# EAGLE design ButterflyFC (EAGLE 9.6.2)
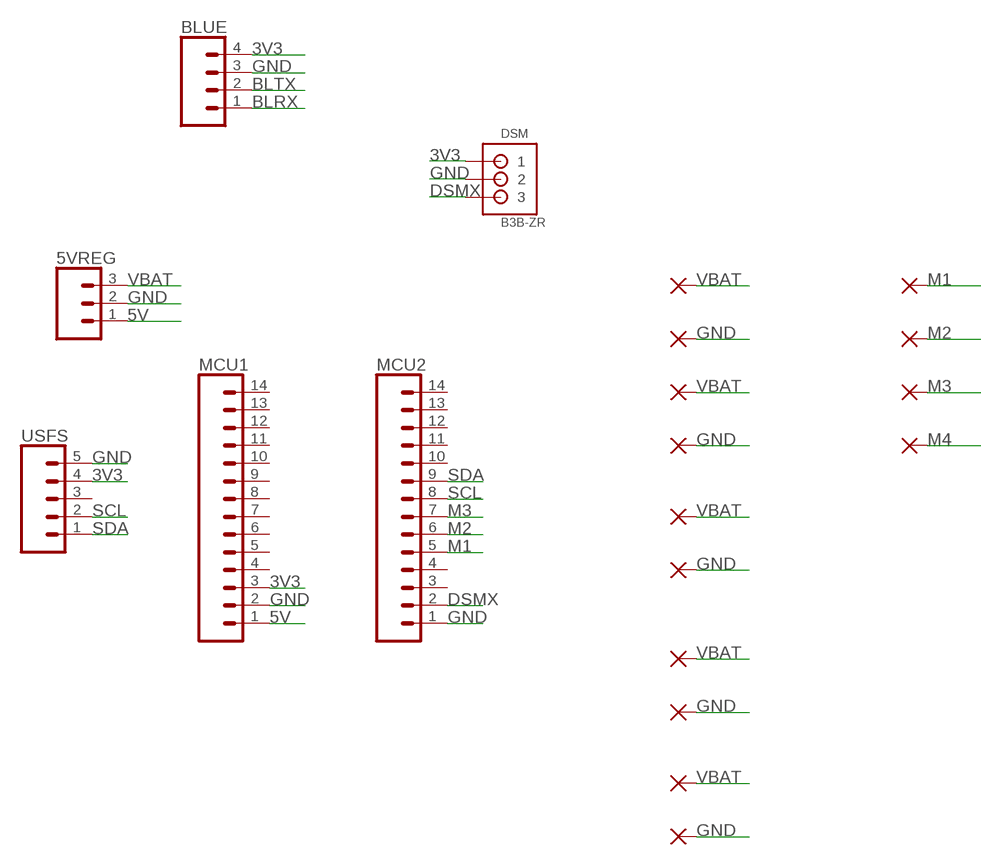
[diagram p0: schematic, sheet 1]

## Parts
5VREG  CONN_031X03_NO_SILK  [1X03_NO_SILK]
BLUE  CONN_041X04_NO_SILK  [1X04_NO_SILK]
DSM  B3B-ZR  [B3B-ZR]
MCU1  CONN_14NO_SILK  [1X14_NO_SILK]
MCU2  CONN_14NO_SILK  [1X14_NO_SILK]
PAD1  WIREPADSMD5-2,5  [5-2,5]
PAD2  WIREPADSMD5-2,5  [5-2,5]
PAD3  WIREPADSMD5-2,5  [5-2,5]
PAD4  WIREPADSMD5-2,5  [5-2,5]
PAD5  WIREPADSMD5-2,5  [5-2,5]
PAD6  WIREPADSMD5-2,5  [5-2,5]
PAD7  WIREPADSMD5-2,5  [5-2,5]
PAD8  WIREPADSMD5-2,5  [5-2,5]
PAD9  WIREPADSMD5-2,5  [5-2,5]
PAD10  WIREPADSMD5-2,5  [5-2,5]
PAD11  WIREPADSMD5-2,5  [5-2,5]
PAD12  WIREPADSMD5-2,5  [5-2,5]
PAD13  WIREPADSMD5-2,5  [5-2,5]
PAD14  WIREPADSMD5-2,5  [5-2,5]
USFS  CONN_05NO_SILK  [1X05_NO_SILK]

## Nets
3V3: BLUE.4 DSM.1 MCU1.3 USFS.4
5V: 5VREG.1 MCU1.1
BLRX: BLUE.1
BLTX: BLUE.2
DSMX: DSM.3 MCU2.2
GND: 5VREG.2 BLUE.3 DSM.2 MCU1.2 MCU2.1 PAD2.1(P) PAD4.1(P) PAD6.1(P) PAD8.1(P) PAD10.1(P) USFS.5
M1: MCU2.5 PAD13.1(P)
M2: MCU2.6 PAD14.1(P)
M3: MCU2.7 PAD11.1(P)
M4: PAD12.1(P)
SCL: MCU2.8 USFS.2
SDA: MCU2.9 USFS.1
VBAT: 5VREG.3 PAD1.1(P) PAD3.1(P) PAD5.1(P) PAD7.1(P) PAD9.1(P)
Unconnected: MCU1.4 MCU1.5 MCU1.6 MCU1.7 MCU1.8 MCU1.9 MCU1.10 MCU1.11 MCU1.12 MCU1.13 MCU1.14 MCU2.3 MCU2.4 MCU2.10 MCU2.11 MCU2.12 MCU2.13 MCU2.14 USFS.3

## Library data of the parts
5VREG = SparkFun-Connectors:CONN_03: Multi connection point. Often used as Generic Header-pin footprint for 0.1 inch spaced/style header connections On any of the 0.1 inch spaced packages, you can populate with these: Break Away Headers - Straight <https://www.sparkfun.com/products/116> (PRT-00116) Break Away Male Headers - Right Angle <https://www.sparkfun.com/products/553> (PRT-00553) Female Headers <https://www.sparkfun.com/products/115> (PRT-00115) Break Away Headers - Machine Pin <https://www.sparkfun.com/products/117> (PRT-00117) Break Away Female Headers - Swiss Machine Pin <https://www.sparkfun.com/products/743> (PRT-00743) Stackable Header - 3 Pin (Female, 0.1") <https://www.sparkfun.com/products/13875> (PRT-13875) For SCREWTERMINALS and SPRING TERMINALS visit here: Screw Terimnals on SparkFun.com <https://www.sparkfun.com/search/results?term=Screw+Terminals> (5mm/3.5mm/2.54mm spacing) This device is also useful as a general connection point to wire up your design to another part of your project. Our various solder wires solder well into these plated through hole pads. Hook-Up Wire - Assortment (Stranded, 22 AWG) <https://www.sparkfun.com/products/11375> (PRT-11375) Hook-Up Wire - Assortment (Solid Core, 22 AWG) <https://www.sparkfun.com/products/11367> (PRT-11367) View the entire wire category on our website here <https://www.sparkfun.com/categories/141> Special notes: Molex polarized connector foot print use with SKU : PRT-08232 with associated crimp pins and housings.
BLUE = SparkFun-Connectors:CONN_04: Multi connection point. Often used as Generic Header-pin footprint for 0.1 inch spaced/style header connections On any of the 0.1 inch spaced packages, you can populate with these: Break Away Headers - Straight <https://www.sparkfun.com/products/116> (PRT-00116) Break Away Male Headers - Right Angle <https://www.sparkfun.com/products/553> (PRT-00553) Female Headers <https://www.sparkfun.com/products/115> (PRT-00115) Break Away Headers - Machine Pin <https://www.sparkfun.com/products/117> (PRT-00117) Break Away Female Headers - Swiss Machine Pin <https://www.sparkfun.com/products/743> (PRT-00743) For SCREWTERMINALS and SPRING TERMINALS visit here: Screw Terimnals on SparkFun.com <https://www.sparkfun.com/search/results?term=Screw+Terminals> (5mm/3.5mm/2.54mm spacing) This device is also useful as a general connection point to wire up your design to another part of your project. Our various solder wires solder well into these plated through hole pads. Hook-Up Wire - Assortment (Stranded, 22 AWG) <https://www.sparkfun.com/products/11375> (PRT-11375) Hook-Up Wire - Assortment (Solid Core, 22 AWG) <https://www.sparkfun.com/products/11367> (PRT-11367) View the entire wire category on our website here <https://www.sparkfun.com/categories/141> Special notes: Molex polarized connector foot print use with SKU : PRT-08231 with associated crimp pins and housings. 1MM SMD Version SKU: PRT-10208; PROD_ID: CONN-09696
DSM = jst:B3B-ZR: JST-ZH Connector 3 pol, 1.5mm pitch Package: B3B-ZR Source: http://www.jst-mfg.com/product/pdf/eng/eZH.pdf
MCU1 MCU2 = SparkFun-Connectors:CONN_14: Multi connection point. Often used as Generic Header-pin footprint for 0.1 inch spaced/style header connections On any of the 0.1 inch spaced packages, you can populate with these: Break Away Headers - Straight <https://www.sparkfun.com/products/116> (PRT-00116) Break Away Male Headers - Right Angle <https://www.sparkfun.com/products/553> (PRT-00553) Female Headers <https://www.sparkfun.com/products/115> (PRT-00115) Break Away Headers - Machine Pin <https://www.sparkfun.com/products/117> (PRT-00117) Break Away Female Headers - Swiss Machine Pin <https://www.sparkfun.com/products/743> (PRT-00743) For SCREWTERMINALS and SPRING TERMINALS visit here: Screw Terimnals on SparkFun.com <https://www.sparkfun.com/search/results?term=Screw+Terminals> (5mm/3.5mm/2.54mm spacing) This device is also useful as a general connection point to wire up your design to another part of your project. Our various solder wires solder well into these plated through hole pads. Hook-Up Wire - Assortment (Stranded, 22 AWG) <https://www.sparkfun.com/products/11375> (PRT-11375) Hook-Up Wire - Assortment (Solid Core, 22 AWG) <https://www.sparkfun.com/products/11367> (PRT-11367) View the entire wire category on our website here <https://www.sparkfun.com/categories/141> Special notes: Molex polarized connector foot print use with SKU : PRT-08231 with associated crimp pins and housings. 1MM SMD Version SKU: PRT-10208 NOTES ON THE VARIANTS LOCK and LOCK_LONGPADS... This footprint was designed to help hold the alignment of a through-hole component (i.e. 6-pin header) while soldering it into place. You may notice that each hole has been shifted either up or down by 0.005 of an inch from it's more standard position (which is a perfectly straight line). This slight alteration caused the pins (the squares in the middle) to touch the edges of the holes. Because they are alternating, it causes a "brace" to hold the component in place. 0.005 has proven to be the perfect amount of "off-center" position when using our standard breakaway headers. Although looks a little odd when you look at the bare footprint, once you have a header in there, the alteration is very hard to notice. Also,if you push a header all the way into place, it is covered up entirely on the bottom side.
PAD1-PAD14 = wirepad:WIREPAD: Wire PAD connect wire on PCB
USFS = SparkFun-Connectors:CONN_05: Multi connection point. Often used as Generic Header-pin footprint for 0.1 inch spaced/style header connections On any of the 0.1 inch spaced packages, you can populate with these: Break Away Headers - Straight <https://www.sparkfun.com/products/116> (PRT-00116) Break Away Male Headers - Right Angle <https://www.sparkfun.com/products/553> (PRT-00553) Female Headers <https://www.sparkfun.com/products/115> (PRT-00115) Break Away Headers - Machine Pin <https://www.sparkfun.com/products/117> (PRT-00117) Break Away Female Headers - Swiss Machine Pin <https://www.sparkfun.com/products/743> (PRT-00743) For SCREWTERMINALS and SPRING TERMINALS visit here: Screw Terimnals on SparkFun.com <https://www.sparkfun.com/search/results?term=Screw+Terminals> (5mm/3.5mm/2.54mm spacing) This device is also useful as a general connection point to wire up your design to another part of your project. Our various solder wires solder well into these plated through hole pads. Hook-Up Wire - Assortment (Stranded, 22 AWG) <https://www.sparkfun.com/products/11375> (PRT-11375) Hook-Up Wire - Assortment (Solid Core, 22 AWG) <https://www.sparkfun.com/products/11367> (PRT-11367) View the entire wire category on our website here <https://www.sparkfun.com/categories/141> Special notes: Molex polarized connector foot print use with SKU : PRT-08231 with associated crimp pins and housings. 1MM SMD Version SKU: PRT-10208

## Board
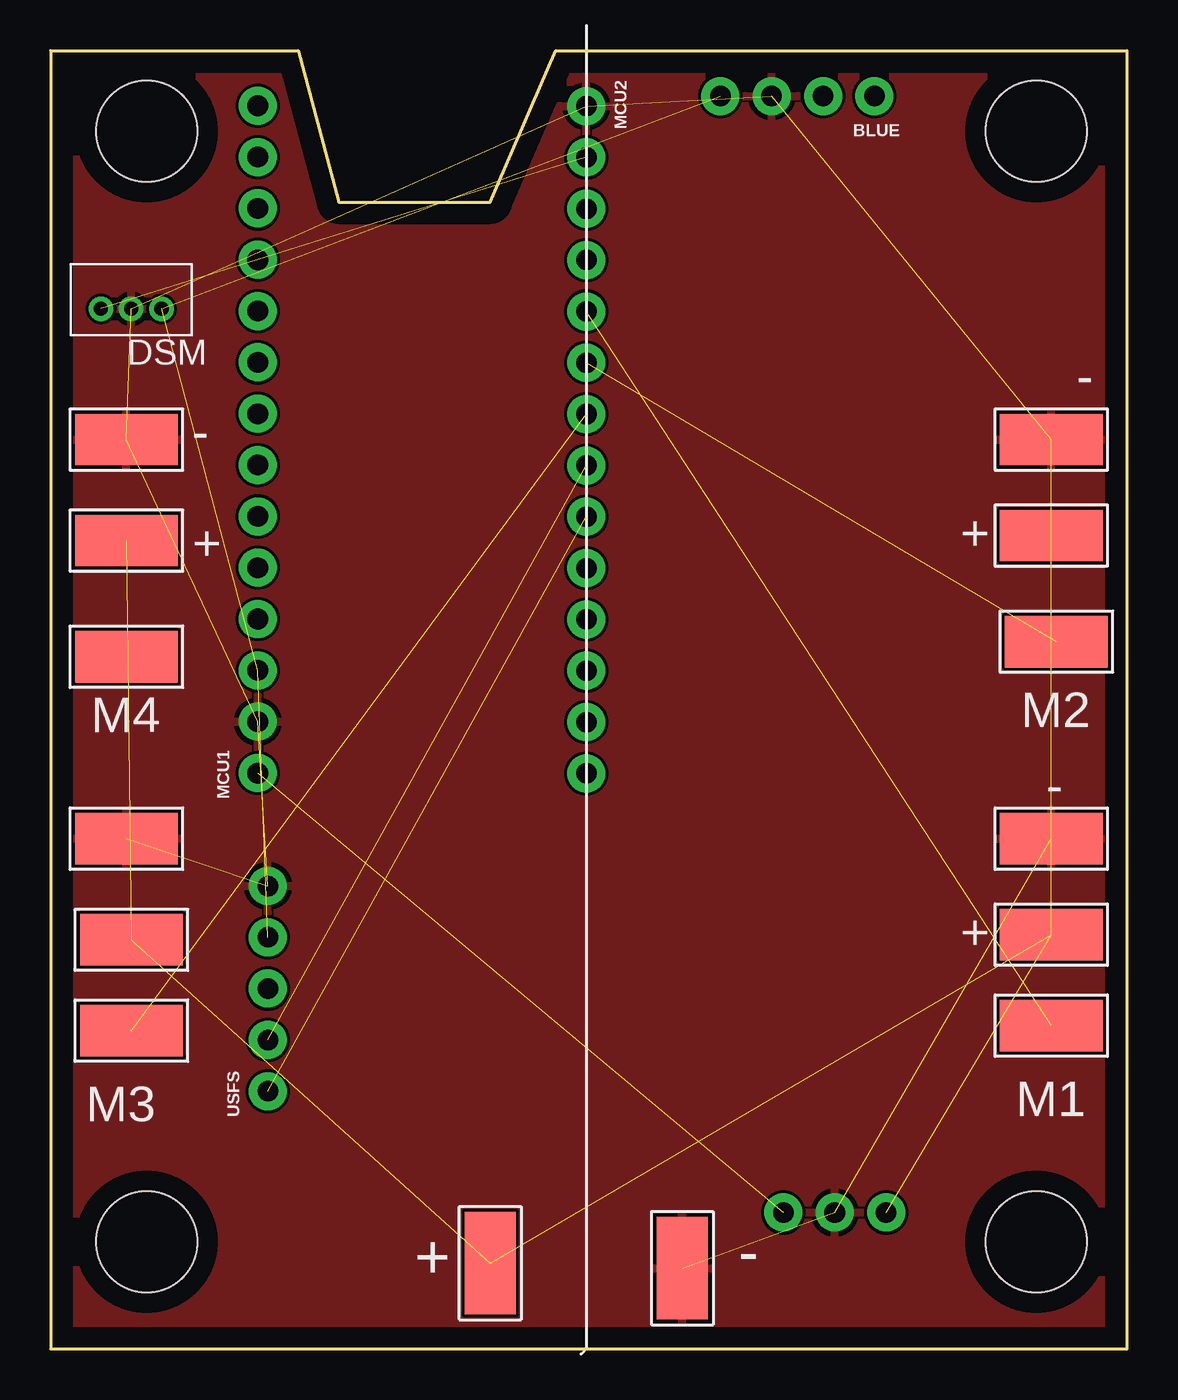
[diagram p1: board, top side]

Size 53.25 x 64.25 mm. Coordinates in mm from the lower left corner, seen from the top.
Outline: 0,64.25 12.25,64.25 14.25,56.75 21.75,56.75 25,64.25 53.25,64.25 53.25,0 0,0 0,64.25
Copper layers (1*16): Top 0.035mm / dielectric 1.5mm / Bottom 0.035mm
Design rules "default": minimum track width 6mil, minimum drill 0.35mm, track to track 6mil, track to pad 6mil, pad to pad 6mil, via to via 6mil, smd to smd 6mil, copper to edge 40mil, drill to drill 6mil, minimum pad ring 10mil, minimum via ring 8mil, stop-mask expansion 4mil, vias tented up to drill 0mil, thermal gap 10mil
Holes 5 mm at 48.75,60.25 4.75,60.25 48.75,5.3 4.75,5.3

### Footprints (pad centres in the part's own frame; a part is rotated, then mirrored left to right if it is on the bottom)
1X03_NO_SILK = drill 1.016 pad 1.88: 1 0,0; 2 2.54,0; 3 5.08,0
1X04_NO_SILK = drill 1.016 pad 1.88: 1 0,0; 2 2.54,0; 3 5.08,0; 4 7.62,0
B3B-ZR = drill 0.7 pad 1.1: 1 -1.5,0; 2 0,0; 3 1.5,0
1X14_NO_SILK = drill 1.016 pad 1.88: 1 0,0; 2 2.54,0; 3 5.08,0; 4 7.62,0; 5 10.16,0; 6 12.7,0; 7 15.24,0; 8 17.78,0; 9 20.32,0; 10 22.86,0; 11 25.4,0; 12 27.94,0; 13 30.48,0; 14 33.02,0
5-2,5 = smd 2.54 x 5.08: 1 0,0
1X05_NO_SILK = drill 1.016 pad 1.88: 1 0,0; 2 2.54,0; 3 5.08,0; 4 7.62,0; 5 10.16,0

### Placement (x,y rotation side)
5VREG  36.25,6.75 0 top
BLUE  40.75,62 180 top
DSM  3.99,51.47 180 top
MCU1  10.25,28.5 90 top
MCU2  26.5,61.5 270 top
PAD1  21.75,4.25 0 top
PAD2  31.25,4 0 top
PAD3  3.75,40 90 top
PAD4  3.75,45 90 top
PAD5  4,20.25 90 top
PAD6  3.75,25.25 90 top
PAD7  49.5,20.5 270 top
PAD8  49.5,25.25 90 top
PAD9  49.5,40.25 90 top
PAD10  49.5,45 90 top
PAD11  4,15.75 90 top
PAD12  3.75,34.25 90 top
PAD13  49.5,16 90 top
PAD14  49.75,35 90 top
USFS  10.75,12.75 90 top

### Tracks (layer width: path | path; a pad name or v marks a point on that pad's centre or on a via)
3V3  (3 unrouted)
5V  (1 unrouted)
DSMX  (1 unrouted)
GND  (10 unrouted)
  pour Top: 0.17,64 53.16,64 52.73,-0.25 -0.26,-0.25
M1  (1 unrouted)
M2  (1 unrouted)
M3  (1 unrouted)
SCL  (1 unrouted)
SDA  (1 unrouted)
VBAT  (5 unrouted)

### Text on the board
tPlace: - | - | + | + | M2 | M4 | - | + | M1 | M3 | + | -